# Altium schematic sheet midi.SchDoc
size Letter
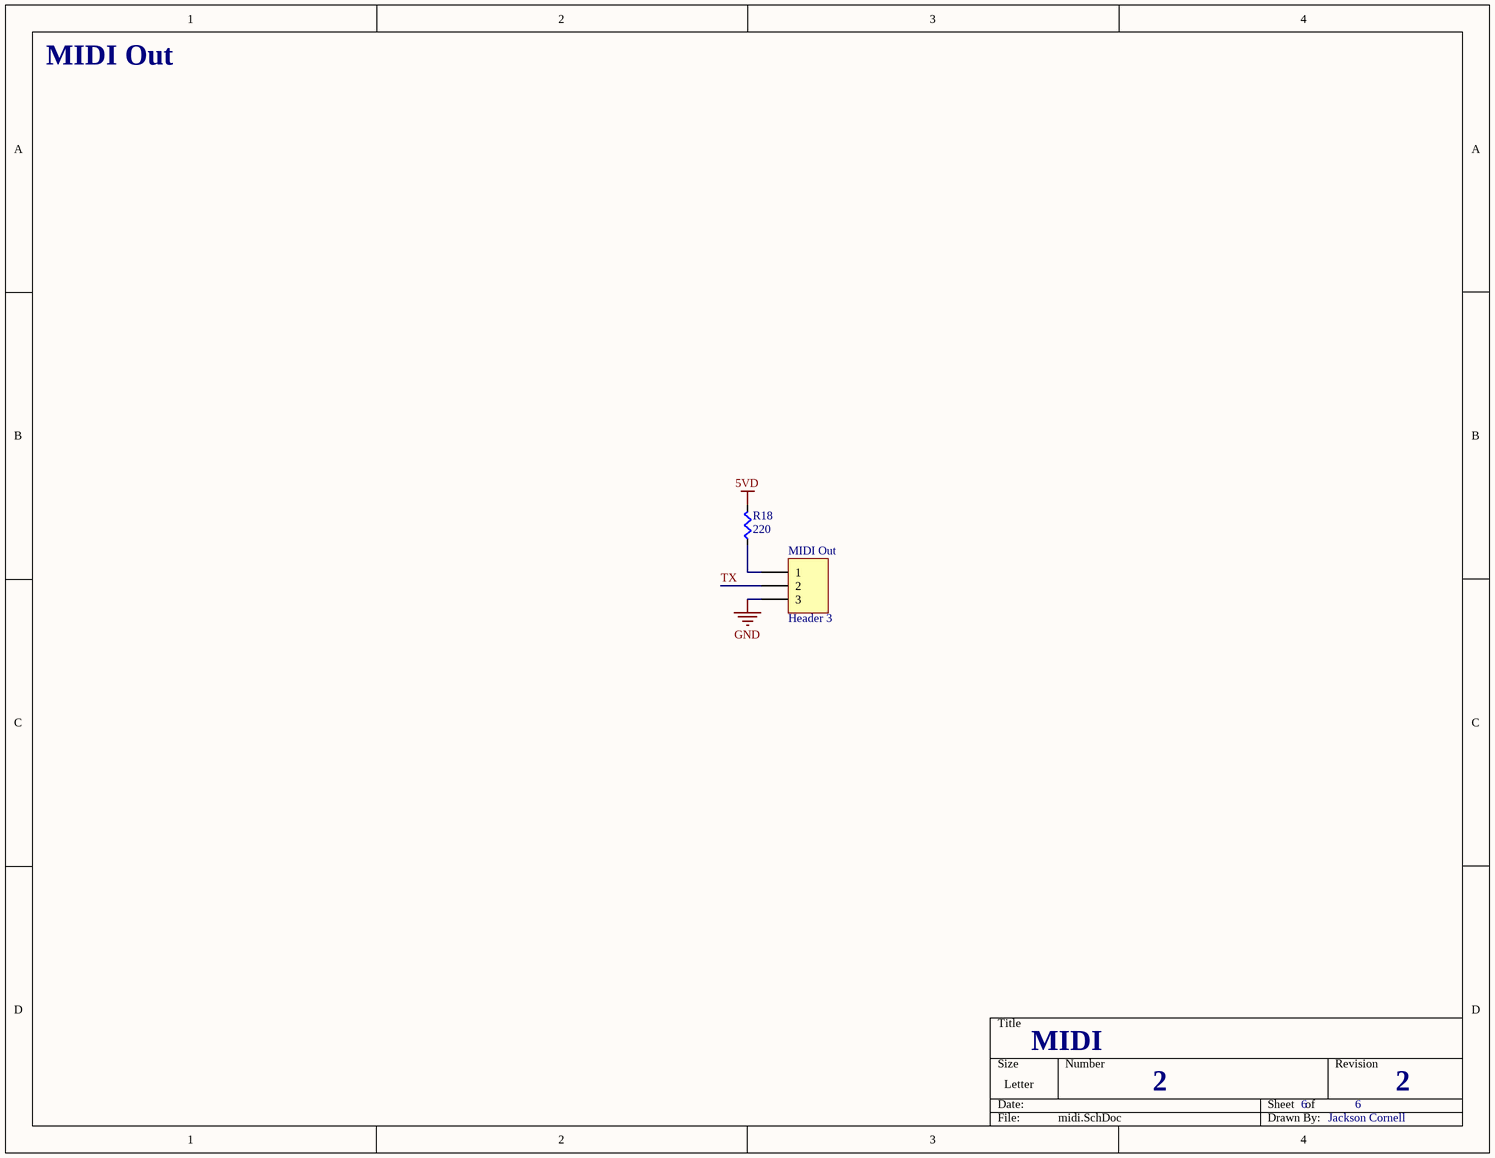
[diagram p0: midi.SchDoc]

## Parts
MIDI_Out  Header 3  [HDR1X3]
R18  value 220  [RES0805]  (hidden comment: Res)

## Nets
5VD: R18.1(A)
GND: MIDI_Out.3
TX: MIDI_Out.2
NetMIDI_Out_1: MIDI_Out.1 R18.2(B)

## Notes on the sheet
- MIDI Out
- MIDI
- 2
- 6
- Jackson Cornell

## Library data of the parts
MIDI_Out = Header 3: Header, 3-Pin; LatestRevisionDate: 17-Jul-2002; LatestRevisionNote: Re-released for DXP Platform.; Publisher: Altium Limited
R18 = Res: Supplier 1: Digi-Key; Supplier Part Number 1: RMCF0603JT10K0CT-ND